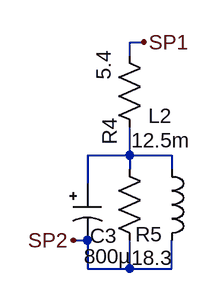
[diagram p0: schematic Parlante.asc]
Parlante.asc, the LTspice schematic file:
Version 4
SHEET 1 880 728
WIRE 560 384 560 400
WIRE 560 384 608 384
WIRE 608 384 608 400
WIRE 560 512 560 480
WIRE 560 512 608 512
WIRE 608 512 608 480
WIRE 560 384 560 352
WIRE 560 272 560 256
WIRE 512 384 512 416
WIRE 512 384 560 384
WIRE 512 480 512 512
WIRE 512 512 560 512
WIRE 560 256 576 256
WIRE 496 480 512 480
FLAG 576 256 SP1
FLAG 496 480 SP2
SYMBOL res 576 368 R180
WINDOW 0 54 11 VBottom 0
WINDOW 3 30 86 VTop 0
SYMATTR InstName R4
SYMATTR Value 5.4
SYMATTR SpiceLine tol=1 pwr=0.1
SYMBOL res 576 496 R180
WINDOW 0 -21 23 Left 0
WINDOW 3 -33 -4 Left 0
SYMATTR InstName R5
SYMATTR Value 18.3
SYMATTR SpiceLine tol=1 pwr=0.1
SYMBOL ind 592 384 R0
WINDOW 0 -11 -45 Left 0
WINDOW 3 -30 -17 Left 0
SYMATTR InstName L2
SYMATTR Value 12.5m
SYMATTR SpiceLine Rser=1m Rpar=45000 Cpar=220f
SYMBOL polcap 496 416 R0
WINDOW 0 19 59 Left 0
WINDOW 3 12 82 Left 0
SYMATTR InstName C3
SYMATTR Value 800µ
SYMATTR Description Capacitor
SYMATTR Type cap
SYMATTR SpiceLine V=50 MTBF=5000 Lser=0 ppPkg=1

The netlist it stands for:
* Parlante.asc
R4 N001 SP1 5.4 tol=1 pwr=0.1
R5 SP2 N001 18.3 tol=1 pwr=0.1
L2 N001 SP2 12.5m Rser=1m Rpar=45000 Cpar=220f
C3 N001 SP2 800µ V=50 MTBF=5000 Lser=0 ppPkg=1
.backanno
.end